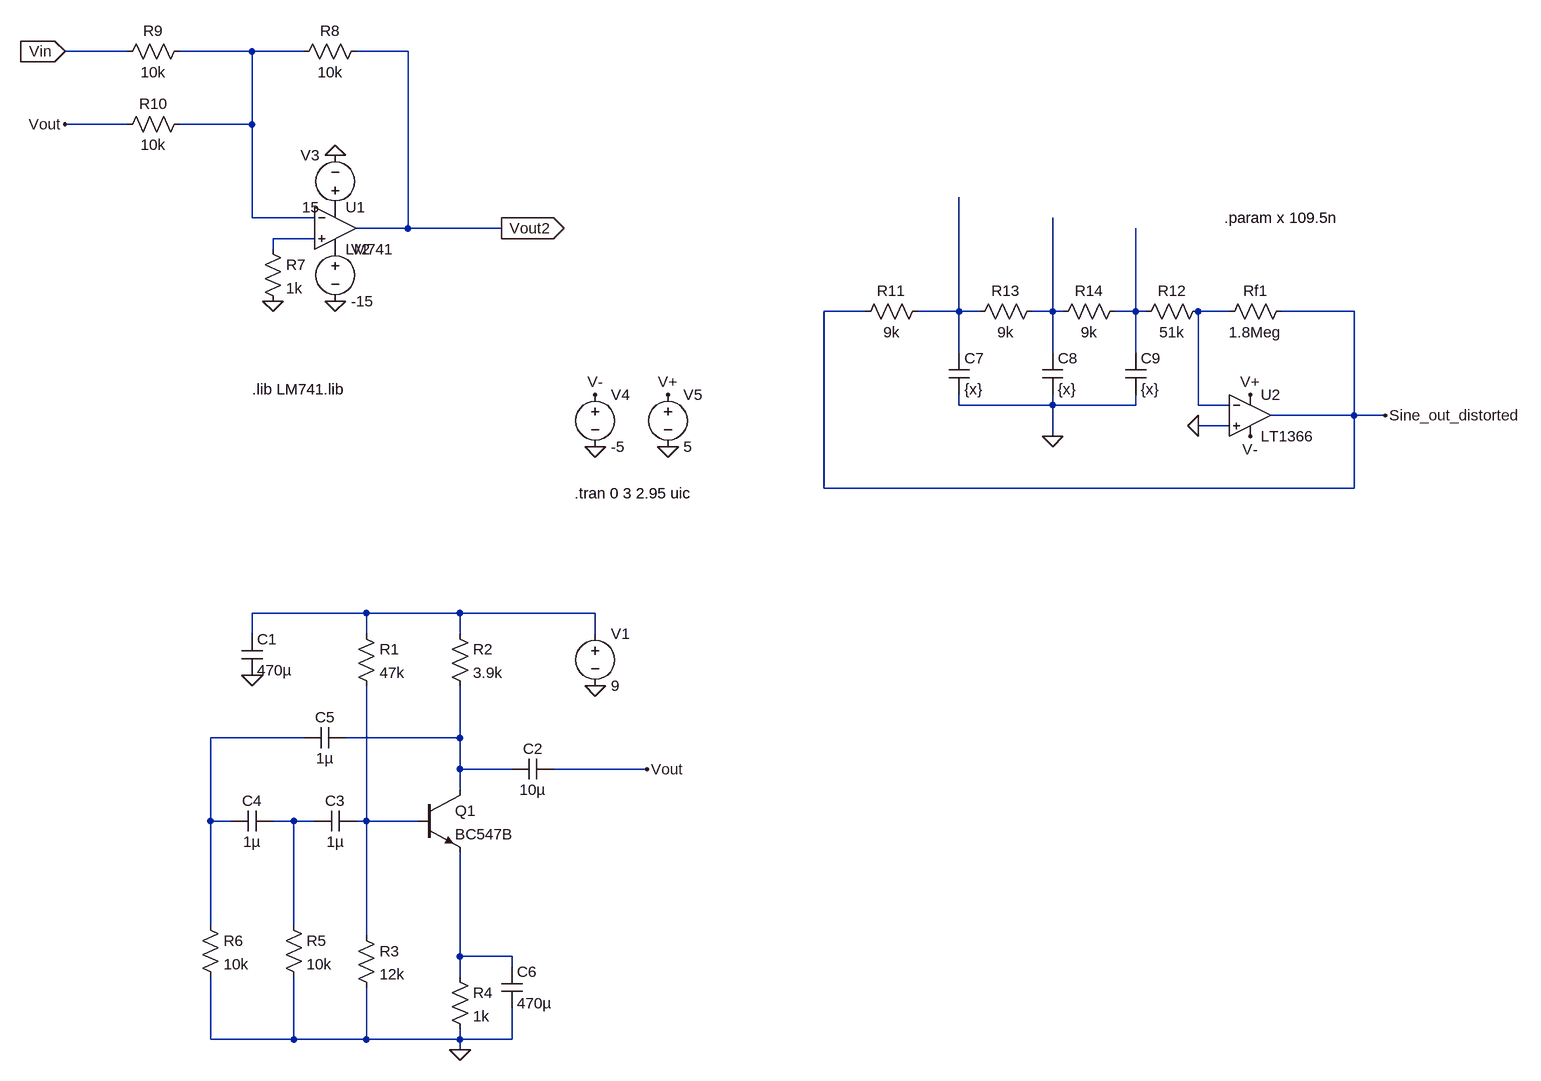
[diagram p0: schematic Draft26.asc]
Draft26.asc, the LTspice schematic file:
Version 4
SHEET 1 2124 680
WIRE -32 -960 -128 -960
WIRE 160 -960 48 -960
WIRE 240 -960 160 -960
WIRE 400 -960 320 -960
WIRE -32 -848 -128 -848
WIRE 160 -848 160 -960
WIRE 160 -848 48 -848
WIRE 160 -704 160 -848
WIRE 256 -704 160 -704
WIRE 400 -688 400 -960
WIRE 400 -688 320 -688
WIRE 544 -688 400 -688
WIRE 256 -672 192 -672
WIRE 192 -656 192 -672
WIRE 1104 -560 1040 -560
WIRE 1248 -560 1248 -736
WIRE 1248 -560 1184 -560
WIRE 1280 -560 1248 -560
WIRE 1392 -560 1392 -704
WIRE 1392 -560 1360 -560
WIRE 1408 -560 1392 -560
WIRE 1520 -560 1520 -688
WIRE 1520 -560 1488 -560
WIRE 1536 -560 1520 -560
WIRE 1664 -560 1616 -560
WIRE 1856 -560 1744 -560
WIRE 1248 -496 1248 -560
WIRE 1392 -496 1392 -560
WIRE 1520 -496 1520 -560
WIRE 1248 -416 1248 -432
WIRE 1392 -416 1392 -432
WIRE 1392 -416 1248 -416
WIRE 1520 -416 1520 -432
WIRE 1520 -416 1392 -416
WIRE 1616 -416 1616 -560
WIRE 1664 -416 1616 -416
WIRE 1856 -400 1856 -560
WIRE 1856 -400 1728 -400
WIRE 1904 -400 1856 -400
WIRE 1664 -384 1616 -384
WIRE 1392 -368 1392 -416
WIRE 1040 -288 1040 -560
WIRE 1856 -288 1856 -400
WIRE 1856 -288 1040 -288
WIRE 336 -96 160 -96
WIRE 480 -96 336 -96
WIRE 688 -96 480 -96
WIRE 160 -64 160 -96
WIRE 336 -64 336 -96
WIRE 480 -64 480 -96
WIRE 688 -64 688 -96
WIRE 240 96 96 96
WIRE 480 96 480 16
WIRE 480 96 304 96
WIRE 480 144 480 96
WIRE 560 144 480 144
WIRE 768 144 624 144
WIRE 480 176 480 144
WIRE 96 224 96 96
WIRE 128 224 96 224
WIRE 224 224 192 224
WIRE 256 224 224 224
WIRE 336 224 336 16
WIRE 336 224 320 224
WIRE 416 224 336 224
WIRE 96 384 96 224
WIRE 224 384 224 224
WIRE 336 400 336 224
WIRE 480 432 480 272
WIRE 560 432 480 432
WIRE 560 448 560 432
WIRE 480 464 480 432
WIRE 96 560 96 464
WIRE 224 560 224 464
WIRE 224 560 96 560
WIRE 336 560 336 480
WIRE 336 560 224 560
WIRE 480 560 480 544
WIRE 480 560 336 560
WIRE 560 560 560 512
WIRE 560 560 480 560
WIRE 480 576 480 560
FLAG 480 576 0
FLAG 768 144 Vout
FLAG 688 16 0
FLAG 160 0 0
FLAG 288 -800 0
FLAG 288 -576 0
FLAG 192 -576 0
FLAG -128 -848 Vout
FLAG -128 -960 Vin
IOPIN -128 -960 In
FLAG 544 -688 Vout2
IOPIN 544 -688 Out
FLAG 688 -352 0
FLAG 800 -352 0
FLAG 800 -432 V+
FLAG 688 -432 V-
FLAG 1696 -368 V-
FLAG 1696 -432 V+
FLAG 1904 -400 Sine_out_distorted
FLAG 1616 -384 0
FLAG 1392 -368 0
SYMBOL res 320 -80 R0
SYMATTR InstName R1
SYMATTR Value 47k
SYMBOL res 464 -80 R0
SYMATTR InstName R2
SYMATTR Value 3.9k
SYMBOL npn 416 176 R0
SYMATTR InstName Q1
SYMATTR Value BC547B
SYMBOL res 320 384 R0
SYMATTR InstName R3
SYMATTR Value 12k
SYMBOL res 464 448 R0
SYMATTR InstName R4
SYMATTR Value 1k
SYMBOL voltage 688 -80 R0
SYMATTR InstName V1
SYMATTR Value 9
SYMBOL res 208 368 R0
SYMATTR InstName R5
SYMATTR Value 10k
SYMBOL res 80 368 R0
SYMATTR InstName R6
SYMATTR Value 10k
SYMBOL cap 144 -64 R0
SYMATTR InstName C1
SYMATTR Value 470µ
SYMBOL cap 624 128 R90
WINDOW 0 0 32 VBottom 2
WINDOW 3 32 32 VTop 2
SYMATTR InstName C2
SYMATTR Value 10µ
SYMBOL cap 320 208 R90
WINDOW 0 0 32 VBottom 2
WINDOW 3 32 32 VTop 2
SYMATTR InstName C3
SYMATTR Value 1µ
SYMBOL cap 192 208 R90
WINDOW 0 0 32 VBottom 2
WINDOW 3 32 32 VTop 2
SYMATTR InstName C4
SYMATTR Value 1µ
SYMBOL cap 304 80 R90
WINDOW 0 0 32 VBottom 2
WINDOW 3 32 32 VTop 2
SYMATTR InstName C5
SYMATTR Value 1µ
SYMBOL cap 544 448 R0
SYMATTR InstName C6
SYMATTR Value 470µ
SYMBOL Opamps/opamp2 288 -752 R0
SYMATTR InstName U1
SYMATTR Value LM741
SYMBOL voltage 288 -672 R0
SYMATTR InstName V2
SYMATTR Value -15
SYMBOL voltage 288 -704 R180
WINDOW 0 24 96 Left 2
WINDOW 3 24 16 Left 2
SYMATTR InstName V3
SYMATTR Value 15
SYMBOL res 176 -672 R0
SYMATTR InstName R7
SYMATTR Value 1k
SYMBOL res 336 -976 R90
WINDOW 0 0 56 VBottom 2
WINDOW 3 32 56 VTop 2
SYMATTR InstName R8
SYMATTR Value 10k
SYMBOL res 64 -976 R90
WINDOW 0 0 56 VBottom 2
WINDOW 3 32 56 VTop 2
SYMATTR InstName R9
SYMATTR Value 10k
SYMBOL res 64 -864 R90
WINDOW 0 0 56 VBottom 2
WINDOW 3 32 56 VTop 2
SYMATTR InstName R10
SYMATTR Value 10k
SYMBOL voltage 688 -448 R0
SYMATTR InstName V4
SYMATTR Value -5
SYMBOL voltage 800 -448 R0
SYMATTR InstName V5
SYMATTR Value 5
SYMBOL LT1366 1696 -464 R0
SYMATTR InstName U2
SYMBOL res 1760 -576 R90
WINDOW 0 0 56 VBottom 2
WINDOW 3 32 56 VTop 2
SYMATTR InstName Rf1
SYMATTR Value 1.8Meg
SYMBOL cap 1232 -496 R0
SYMATTR InstName C7
SYMATTR Value {x}
SYMBOL res 1200 -576 R90
WINDOW 0 0 56 VBottom 2
WINDOW 3 32 56 VTop 2
SYMATTR InstName R11
SYMATTR Value 9k
SYMBOL res 1632 -576 R90
WINDOW 0 0 56 VBottom 2
WINDOW 3 32 56 VTop 2
SYMATTR InstName R12
SYMATTR Value 51k
SYMBOL cap 1376 -496 R0
SYMATTR InstName C8
SYMATTR Value {x}
SYMBOL cap 1504 -496 R0
SYMATTR InstName C9
SYMATTR Value {x}
SYMBOL res 1376 -576 R90
WINDOW 0 0 56 VBottom 2
WINDOW 3 32 56 VTop 2
SYMATTR InstName R13
SYMATTR Value 9k
SYMBOL res 1504 -576 R90
WINDOW 0 0 56 VBottom 2
WINDOW 3 32 56 VTop 2
SYMATTR InstName R14
SYMATTR Value 9k
TEXT 160 -440 Left 2 !.lib LM741.lib
TEXT 656 -280 Left 2 !.tran 0 3 2.95 uic
TEXT 1656 -704 Left 2 !.param x 109.5n

The netlist it stands for:
* Draft26.asc
R1 N007 N011 47k
R2 N007 N009 3.9k
Q1 N009 N011 N012 0 BC547B
R3 N011 0 12k
R4 N012 0 1k
V1 N007 0 9
R5 N010 0 10k
R6 N008 0 10k
C1 N007 0 470µ
C2 Vout N009 10µ
C3 N011 N010 1µ
C4 N010 N008 1µ
C5 N009 N008 1µ
C6 N012 0 470µ
XU1 N002 N001 P001 P002 Vout2 LM741  ; pins In+ In- V+ V- OUT
V2 P002 0 -15
V3 P001 0 15
R7 N002 0 1k
R8 Vout2 N001 10k
R9 N001 Vin 10k
R10 N001 Vout 10k
V4 V- 0 -5
V5 V+ 0 5
XU2 0 N006 V+ V- Sine_out_distorted LT1366  ; pins In+ In- V+ V- OUT
Rf1 Sine_out_distorted N006 1.8Meg
C7 N003 0 {x}
R11 N003 Sine_out_distorted 9k
R12 N006 N005 51k
C8 N004 0 {x}
C9 N005 0 {x}
R13 N004 N003 9k
R14 N005 N004 9k
.model NPN NPN
.model PNP PNP
.lib standard.bjt
.lib LM741.lib
.tran 0 3 2.95 uic
.param x 109.5n
.lib LTC.lib
.backanno
.end